# EAGLE design Adapter-IO4-Grove (EAGLE 7.7.0)
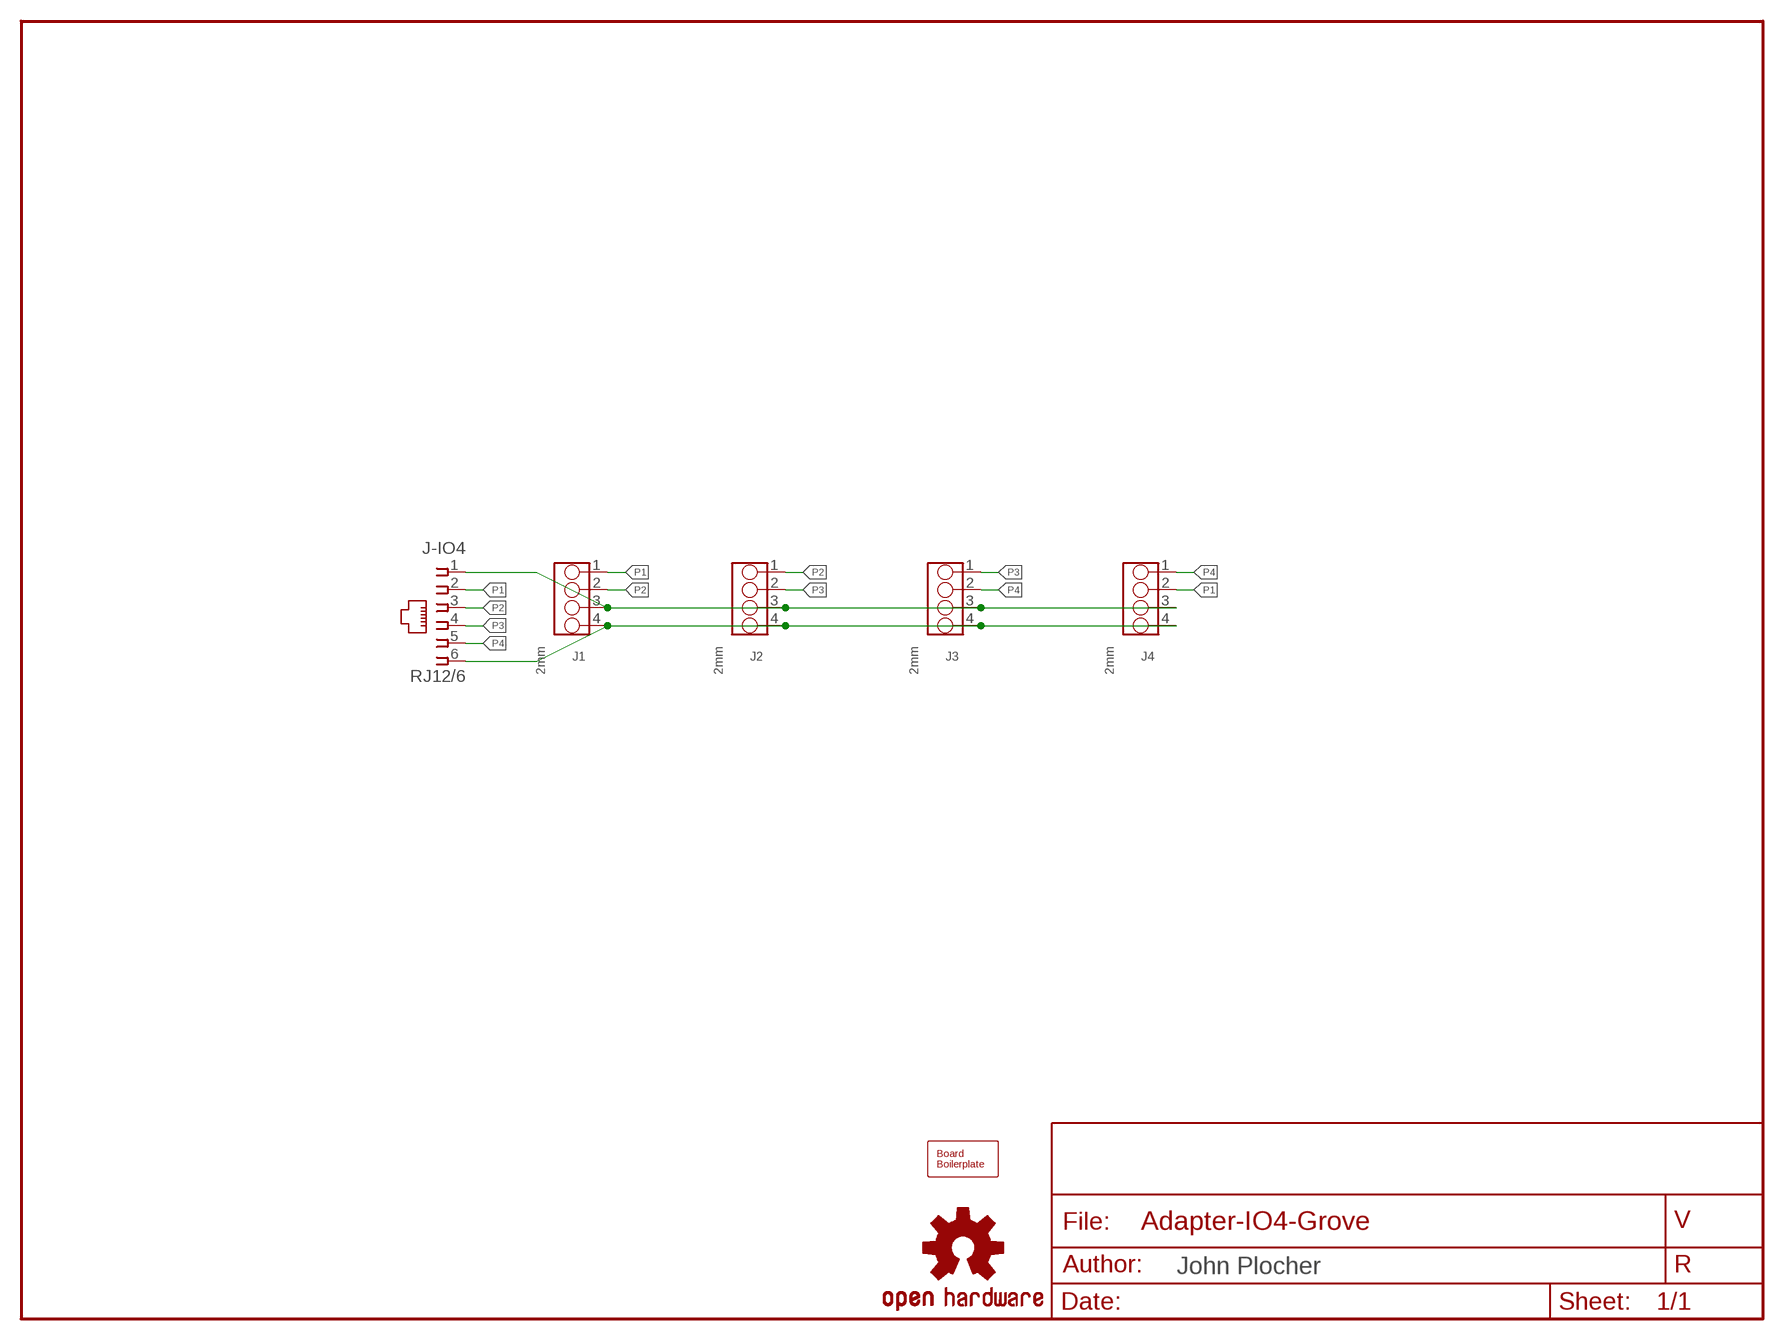
[diagram p0: schematic, sheet 1]

## Parts
J1  2mm  CONNECTOR-GROVE-4P-2.0-3470130P1  [4P-2.0]
J2  2mm  CONNECTOR-GROVE-4P-2.0-3470130P1  [4P-2.0]
J3  2mm  CONNECTOR-GROVE-4P-2.0-3470130P1  [4P-2.0]
J4  2mm  CONNECTOR-GROVE-4P-2.0-3470130P1  [4P-2.0]
J-IO4  RJ12/6  CONNECTOR-RJ25-43860-2-MOLEX  [RJ25-INVERTED]
LOGO1  OSHW  DOC-OSHW-LOGO-L  [OSHW-LOGO-L]
U$1  BOARD  BOARD50X50  [BOARD-SEEED5X5]

## Nets
GND: J1.4 J2.4 J3.4 J4.4 J-IO4.6
P1: J1.1 J4.2 J-IO4.2
P2: J1.2 J2.1 J-IO4.3
P3: J2.2 J3.1 J-IO4.4
P4: J3.2 J4.1 J-IO4.5
V5: J1.3 J2.3 J3.3 J4.3 J-IO4.1

## Library data of the parts
J1-J4 = SPCoast:CONNECTOR-GROVE-4P-2.0
J-IO4 = SPCoast:CONNECTOR-RJ25: AMP connector
LOGO1 = SPCoast:DOC-OSHW-LOGO-: Open Source Hardware Logo This logo indicates the piece of hardware it is found on incorporates a OSHW license and/or adheres to the definition of open source hardware http://freedomdefined.org/OSHW Creative Commons - Attribution - ShareAlike 3.0
U$1 = SPCoast:BOARD

## Net classes
0 default: width 0.305 mm

## Board
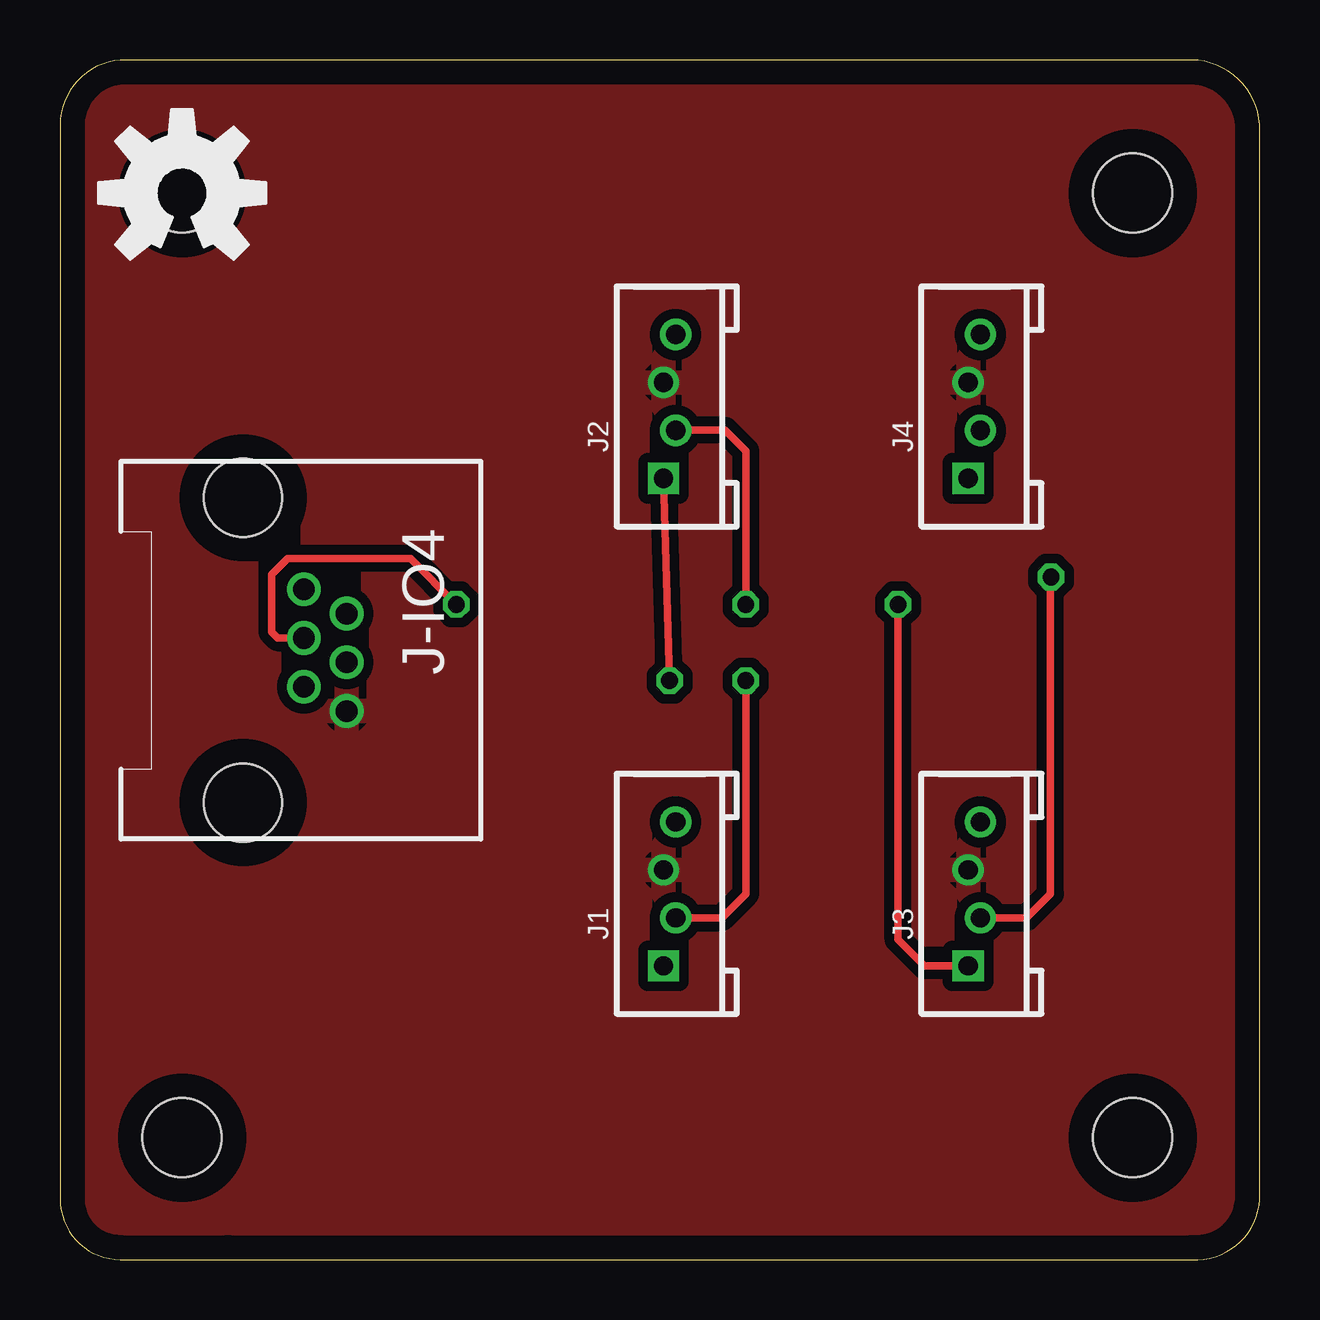
[diagram p1: board, top side]
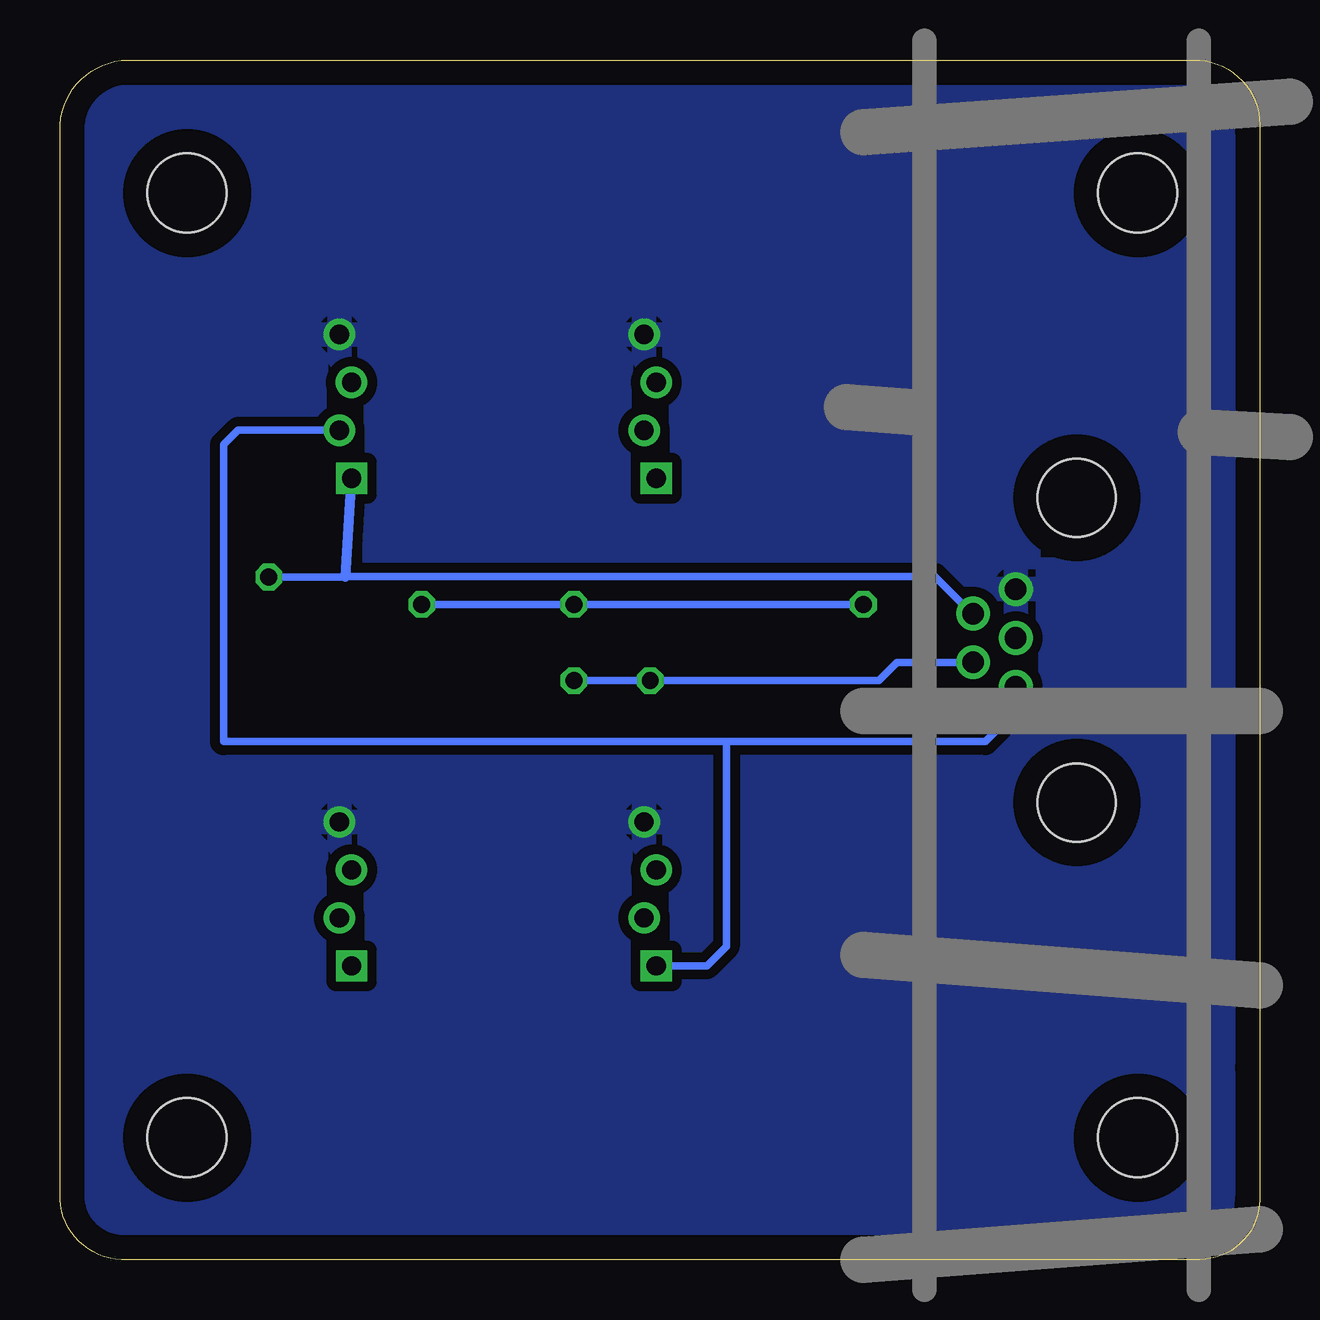
[diagram p2: board, bottom side, seen from below]

Size 50.01 x 50 mm. Coordinates in mm from the lower left corner, seen from the top.
Copper layers (1*16): Top 0.035mm / dielectric 1.5mm / Bottom 0.035mm
Design rules "default": minimum track width 10mil, minimum drill 0.6mm, track to track 8mil, track to pad 8mil, pad to pad 8mil, via to via 8mil, smd to smd 8mil, copper to edge 40mil, drill to drill 8mil, minimum pad ring 10mil, minimum via ring 8mil, stop-mask expansion 4mil, vias tented up to drill 0mil, thermal gap 10mil

### Footprints (pad centres in the part's own frame; a part is rotated, then mirrored left to right if it is on the bottom)
4P-2.0 = drill 0.8 pad 1.27 square: 1 -3,0.254 | drill 0.8 pad 1.27: 2 -1,-0.254; 3 1,0.254; 4 3,-0.254
RJ25-INVERTED = drill 0.9 pad 1.4: 1 2.54,4.318; 2 1.524,2.54; 3 0.508,4.318; 4 -0.508,2.54; 5 -1.524,4.318; 6 -2.54,2.54 | hole 3.251: -6.35,0; 6.35,0
BOARD-SEEED5X5 = hole 3.3: 44.704,5.08; 5.08,44.45; 44.704,44.45; 5.08,5.08

### Placement (x,y rotation side)
J1  25.41,15.24 90 top
J2  25.41,35.56 90 top
J3  38.11,15.24 90 top
J4  38.11,35.56 90 top
J-IO4  7.63,25.4 270 top
LOGO1  5.09,44.45 0 top
U$1  0.01,0 0 top

### Tracks (layer width: path | path; a pad name or v marks a point on that pad's centre or on a via)
GND
  pour Bottom (isolate 0.406): 0.01,-0.63 0.01,49.53 49.54,49.53 49.54,-0.63
P1
  Bottom 0.305: J-IO4.2 10.17,22.89 11.44,21.59 22.23,21.59 | 22.23,21.59 43.19,21.59 43.19,33.96 42.58,34.57 38.12,34.57 J4.2 | 22.23,21.59 22.23,13.06 23.05,12.25 25.41,12.25 J1.1
P2  (via drill 0.7)
  Top 0.305: v25.41,24.13 J2.1 | J1.2 27.58,14.24 28.58,15.24 v28.58,24.13
  Bottom 0.305: J-IO4.3 11.9,24.9 12.58,24.9 15.12,24.9 15.88,24.13 v25.41,24.13 v28.58,24.13
P3  (via drill 0.7)
  Top 0.305: v28.58,27.31 28.58,33.71 27.72,34.57 25.42,34.57 J2.2 | J3.1 36.03,12.24 34.93,13.34 v34.93,27.31 | v16.52,27.31 14.61,29.21 9.48,29.21 8.82,28.55 8.82,26.17 9.08,25.91 J-IO4.4
  Bottom 0.305: v16.52,27.31 28.46,27.31 v28.58,27.31 v34.93,27.31
P4  (via drill 0.7)
  Top 0.305: J3.2 40.28,14.24 41.28,15.24 41.28,28.43 v41.31,28.45
  Bottom 0.305: J-IO4.5 12,26.93 13.55,28.48 38.08,28.48 38.11,28.45 v41.31,28.45
  Bottom 0.406: 38.11,28.45 J4.1
V5
  pour Top (isolate 0.406): 0.01,49.53 49.54,49.53 49.54,-0.63 0.01,-0.63

### Text on the board
tDocu: V1.0 | OSHW | 2014.10 | John Plocher | 2 3 + - | 4 1 + - | IO4-Grove | 1 2 + - | 3 4 + -
bDocu: Model Railroading is Fun! | IO4-Grove | Go Bears! | www.SPCoast.com | Made in the PCR, Coast Division, NMRA